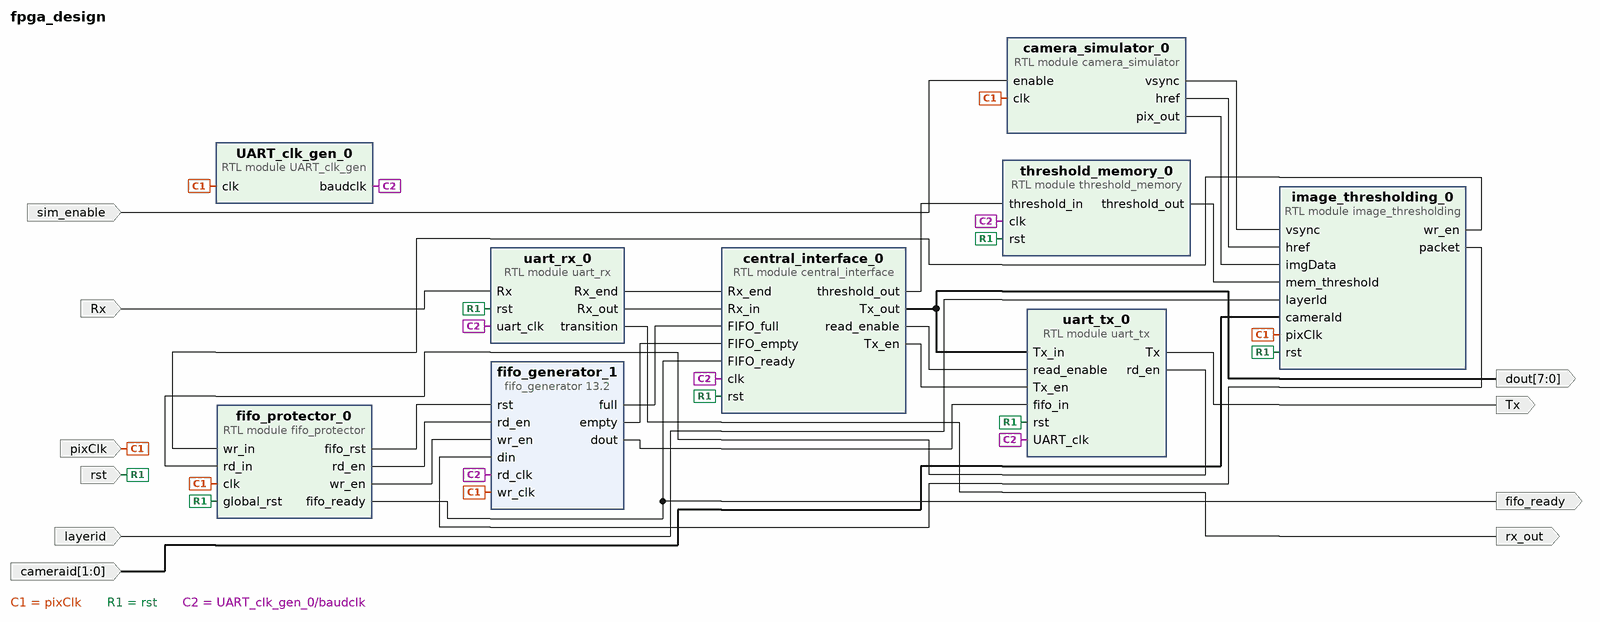
[diagram p0: block diagram of the top level]
# Vivado block design fpga_design, xc7a35tcpg236-1, Vivado 2018.2
create_bd_design fpga_design

create_bd_port -dir O Tx
create_bd_port -dir I layerid
create_bd_port -dir I -from 1 -to 0 cameraid
create_bd_port -dir I pixClk
create_bd_port -dir I Rx
create_bd_port -dir I rst
create_bd_port -dir I sim_enable
create_bd_port -dir O fifo_ready
create_bd_port -dir O rx_out
create_bd_port -dir O -from 7 -to 0 dout

create_bd_cell -type module -reference threshold_memory threshold_memory_0
create_bd_cell -type module -reference image_thresholding image_thresholding_0
create_bd_cell -type module -reference fifo_protector fifo_protector_0
create_bd_cell -type module -reference UART_clk_gen UART_clk_gen_0
create_bd_cell -type module -reference camera_simulator camera_simulator_0
create_bd_cell -type ip -vlnv xilinx.com:ip:fifo_generator:13.2 fifo_generator_1
set_property -dict [list \
  CONFIG.Fifo_Implementation Independent_Clocks_Builtin_FIFO \
  CONFIG.Input_Data_Width 40 \
  CONFIG.Input_Depth 2048 \
  CONFIG.Write_Clock_Frequency 26 \
] [get_bd_cells fifo_generator_1]
create_bd_cell -type module -reference central_interface central_interface_0
create_bd_cell -type module -reference uart_rx uart_rx_0
create_bd_cell -type module -reference uart_tx uart_tx_0

# ---- connections ----

connect_bd_net [get_bd_pins central_interface_0/read_enable] [get_bd_pins uart_tx_0/read_enable]
connect_bd_net [get_bd_pins central_interface_0/Tx_en] [get_bd_pins uart_tx_0/Tx_en]
connect_bd_net [get_bd_pins central_interface_0/Tx_out] [get_bd_ports dout] [get_bd_pins uart_tx_0/Tx_in]
connect_bd_net [get_bd_pins uart_tx_0/Tx] [get_bd_ports Tx]
connect_bd_net [get_bd_pins uart_tx_0/rd_en] [get_bd_pins fifo_protector_0/rd_in]
connect_bd_net [get_bd_pins image_thresholding_0/wr_en] [get_bd_pins fifo_protector_0/wr_in]
connect_bd_net [get_bd_ports layerid] [get_bd_pins image_thresholding_0/layerId]
connect_bd_net [get_bd_ports cameraid] [get_bd_pins image_thresholding_0/cameraId]
connect_bd_net [get_bd_ports pixClk] \
  [get_bd_pins image_thresholding_0/pixClk] [get_bd_pins fifo_protector_0/clk] [get_bd_pins UART_clk_gen_0/clk] \
  [get_bd_pins camera_simulator_0/clk] [get_bd_pins fifo_generator_1/wr_clk]
connect_bd_net [get_bd_pins threshold_memory_0/threshold_out] [get_bd_pins image_thresholding_0/mem_threshold]
connect_bd_net [get_bd_pins central_interface_0/threshold_out] [get_bd_pins threshold_memory_0/threshold_in]
connect_bd_net [get_bd_pins uart_rx_0/Rx_end] [get_bd_pins central_interface_0/Rx_end]
connect_bd_net [get_bd_ports Rx] [get_bd_pins uart_rx_0/Rx]
connect_bd_net [get_bd_pins camera_simulator_0/vsync] [get_bd_pins image_thresholding_0/vsync]
connect_bd_net [get_bd_pins camera_simulator_0/href] [get_bd_pins image_thresholding_0/href]
connect_bd_net [get_bd_ports rst] \
  [get_bd_pins image_thresholding_0/rst] [get_bd_pins threshold_memory_0/rst] [get_bd_pins fifo_protector_0/global_rst] \
  [get_bd_pins central_interface_0/rst] [get_bd_pins uart_rx_0/rst] [get_bd_pins uart_tx_0/rst]
connect_bd_net [get_bd_ports sim_enable] [get_bd_pins camera_simulator_0/enable]
connect_bd_net [get_bd_pins camera_simulator_0/pix_out] [get_bd_pins image_thresholding_0/imgData]
connect_bd_net -net uart_pll_0_clk_out [get_bd_pins UART_clk_gen_0/baudclk] \
  [get_bd_pins threshold_memory_0/clk] [get_bd_pins fifo_generator_1/rd_clk] [get_bd_pins central_interface_0/clk] \
  [get_bd_pins uart_rx_0/uart_clk] [get_bd_pins uart_tx_0/UART_clk]
connect_bd_net [get_bd_pins fifo_generator_1/full] [get_bd_pins central_interface_0/FIFO_full]
connect_bd_net [get_bd_pins fifo_protector_0/fifo_rst] [get_bd_pins fifo_generator_1/rst]
connect_bd_net [get_bd_pins fifo_protector_0/rd_en] [get_bd_pins fifo_generator_1/rd_en]
connect_bd_net [get_bd_pins fifo_protector_0/wr_en] [get_bd_pins fifo_generator_1/wr_en]
connect_bd_net [get_bd_pins image_thresholding_0/packet] [get_bd_pins fifo_generator_1/din]
connect_bd_net [get_bd_pins fifo_generator_1/empty] [get_bd_pins central_interface_0/FIFO_empty]
connect_bd_net [get_bd_pins fifo_generator_1/dout] [get_bd_pins uart_tx_0/fifo_in]
connect_bd_net [get_bd_pins fifo_protector_0/fifo_ready] [get_bd_pins central_interface_0/FIFO_ready] [get_bd_ports fifo_ready]
connect_bd_net [get_bd_pins uart_rx_0/transition] [get_bd_ports rx_out]
connect_bd_net [get_bd_pins uart_rx_0/Rx_out] [get_bd_pins central_interface_0/Rx_in]

validate_bd_design
save_bd_design
